# EAGLE design breakout (EAGLE 6.6.0)
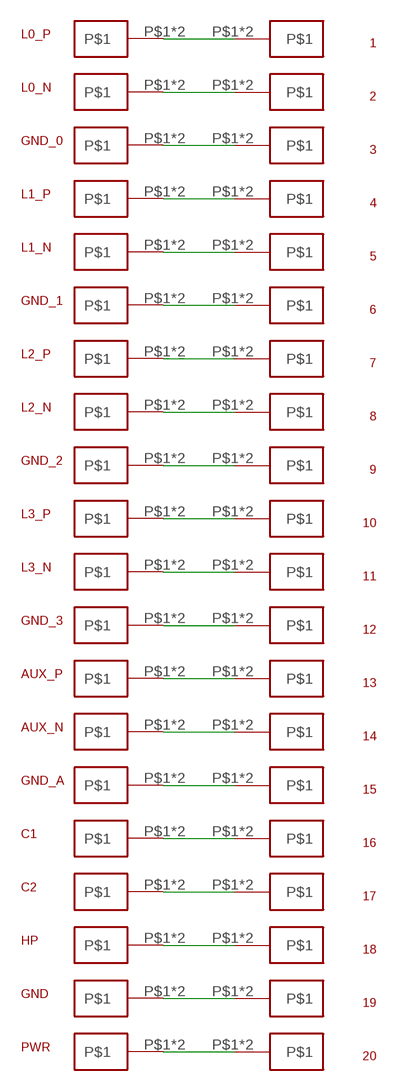
[diagram p0: schematic, sheet 1]

## Parts
1  30_AWG_PAD  [30_AWG_PAD]
2  30_AWG_PAD  [30_AWG_PAD]
3  30_AWG_PAD  [30_AWG_PAD]
4  30_AWG_PAD  [30_AWG_PAD]
5  30_AWG_PAD  [30_AWG_PAD]
6  30_AWG_PAD  [30_AWG_PAD]
7  30_AWG_PAD  [30_AWG_PAD]
8  30_AWG_PAD  [30_AWG_PAD]
9  30_AWG_PAD  [30_AWG_PAD]
10  30_AWG_PAD  [30_AWG_PAD]
11  30_AWG_PAD  [30_AWG_PAD]
12  30_AWG_PAD  [30_AWG_PAD]
13  30_AWG_PAD  [30_AWG_PAD]
14  30_AWG_PAD  [30_AWG_PAD]
15  30_AWG_PAD  [30_AWG_PAD]
16  30_AWG_PAD  [30_AWG_PAD]
17  30_AWG_PAD  [30_AWG_PAD]
18  30_AWG_PAD  [30_AWG_PAD]
19  30_AWG_PAD  [30_AWG_PAD]
20  30_AWG_PAD  [30_AWG_PAD]
AUX_N  30_AWG_PAD  [30_AWG_PAD]
AUX_P  30_AWG_PAD  [30_AWG_PAD]
C1  30_AWG_PAD  [30_AWG_PAD]
C2  30_AWG_PAD  [30_AWG_PAD]
GND  30_AWG_PAD  [30_AWG_PAD]
GND_0  30_AWG_PAD  [30_AWG_PAD]
GND_1  30_AWG_PAD  [30_AWG_PAD]
GND_2  30_AWG_PAD  [30_AWG_PAD]
GND_3  30_AWG_PAD  [30_AWG_PAD]
GND_A  30_AWG_PAD  [30_AWG_PAD]
HP  30_AWG_PAD  [30_AWG_PAD]
L0_N  30_AWG_PAD  [30_AWG_PAD]
L0_P  30_AWG_PAD  [30_AWG_PAD]
L1_N  30_AWG_PAD  [30_AWG_PAD]
L1_P  30_AWG_PAD  [30_AWG_PAD]
L2_N  30_AWG_PAD  [30_AWG_PAD]
L2_P  30_AWG_PAD  [30_AWG_PAD]
L3_N  30_AWG_PAD  [30_AWG_PAD]
L3_P  30_AWG_PAD  [30_AWG_PAD]
PWR  30_AWG_PAD  [30_AWG_PAD]

## Nets
N$1: 1.P$1 1.P$2 L0_P.P$1 L0_P.P$2
N$2: 2.P$1 2.P$2 L0_N.P$1 L0_N.P$2
N$3: 3.P$1 3.P$2 GND_0.P$1 GND_0.P$2
N$4: 4.P$1 4.P$2 L1_P.P$1 L1_P.P$2
N$5: 5.P$1 5.P$2 L1_N.P$1 L1_N.P$2
N$6: 6.P$1 6.P$2 GND_1.P$1 GND_1.P$2
N$7: 7.P$1 7.P$2 L2_P.P$1 L2_P.P$2
N$8: 8.P$1 8.P$2 L2_N.P$1 L2_N.P$2
N$9: 9.P$1 9.P$2 GND_2.P$1 GND_2.P$2
N$10: 10.P$1 10.P$2 L3_P.P$1 L3_P.P$2
N$11: 11.P$1 11.P$2 L3_N.P$1 L3_N.P$2
N$12: 12.P$1 12.P$2 GND_3.P$1 GND_3.P$2
N$13: 13.P$1 13.P$2 AUX_P.P$1 AUX_P.P$2
N$14: 14.P$1 14.P$2 AUX_N.P$1 AUX_N.P$2
N$15: 15.P$1 15.P$2 GND_A.P$1 GND_A.P$2
N$16: 16.P$1 16.P$2 C1.P$1 C1.P$2
N$17: 17.P$1 17.P$2 C2.P$1 C2.P$2
N$18: 18.P$1 18.P$2 HP.P$1 HP.P$2
N$19: 19.P$1 19.P$2 GND.P$1 GND.P$2
N$20: 20.P$1 20.P$2 PWR.P$1 PWR.P$2

## Library data of the parts
1-20 AUX_N AUX_P C1 C2 GND GND_0 GND_1-GND_3 GND_A HP L0_N L0_P L1_N L1_P L2_N L2_P L3_N L3_P PWR = custom:30_AWG_PAD

## Board
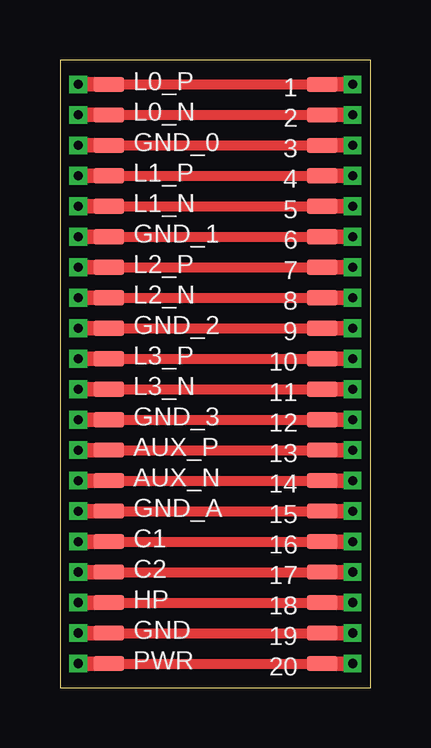
[diagram p1: board, top side]
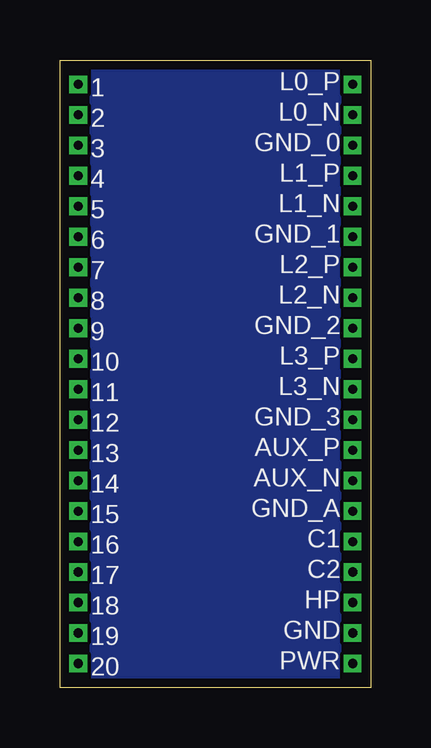
[diagram p2: board, bottom side, seen from below]

Size 12.95 x 26.16 mm. Coordinates in mm from the lower left corner, seen from the top.
Outline: 0,0 12.95,0 12.95,26.16 0,26.16 0,0
Copper layers (1*16): Top 0.0356mm / dielectric 1.5011mm / Bottom 0.0356mm
Design rules "LaenPCBOrder": minimum track width 6mil, minimum drill 13mil, track to track 6mil, track to pad 6mil, pad to pad 6mil, via to via 6mil, smd to smd 6mil, copper to edge 15mil, drill to drill 6mil, minimum pad ring 7mil, minimum via ring 7mil, stop-mask expansion 3mil, vias tented up to drill 0mil, thermal gap 10mil

### Footprints (pad centres in the part's own frame; a part is rotated, then mirrored left to right if it is on the bottom)
30_AWG_PAD = smd 1.27 x 0.635: P$1 0,0 | drill 0.381 pad 0.61 square: P$2 -1.27,0

### Placement (x,y rotation side)
1  10.92,25.15 180 top
2  10.92,23.88 180 top
3  10.92,22.61 180 top
4  10.92,21.34 180 top
5  10.92,20.07 180 top
6  10.92,18.8 180 top
7  10.92,17.53 180 top
8  10.92,16.26 180 top
9  10.92,14.99 180 top
10  10.92,13.72 180 top
11  10.92,12.45 180 top
12  10.92,11.18 180 top
13  10.92,9.91 180 top
14  10.92,8.64 180 top
15  10.92,7.37 180 top
16  10.92,6.1 180 top
17  10.92,4.83 180 top
18  10.92,3.56 180 top
19  10.92,2.29 180 top
20  10.92,1.02 180 top
AUX_N  2.03,8.64 0 top
AUX_P  2.03,9.91 0 top
C1  2.03,6.1 0 top
C2  2.03,4.83 0 top
GND  2.03,2.29 0 top
GND_0  2.03,22.61 0 top
GND_1  2.03,18.8 0 top
GND_2  2.03,14.99 0 top
GND_3  2.03,11.18 0 top
GND_A  2.03,7.37 0 top
HP  2.03,3.56 0 top
L0_N  2.03,23.88 0 top
L0_P  2.03,25.15 0 top
L1_N  2.03,20.07 0 top
L1_P  2.03,21.34 0 top
L2_N  2.03,16.26 0 top
L2_P  2.03,17.53 0 top
L3_N  2.03,12.45 0 top
L3_P  2.03,13.72 0 top
PWR  2.03,1.02 0 top

### Tracks (layer width: path | path; a pad name or v marks a point on that pad's centre or on a via)
N$1
  Top 0.406: L0_P.P$1 1.P$1
  Top 0.61: L0_P.P$2 L0_P.P$1 | 1.P$2 1.P$1
N$2
  Top 0.406: L0_N.P$1 2.P$1
  Top 0.61: L0_N.P$2 L0_N.P$1 | 2.P$2 2.P$1
N$3
  Top 0.406: GND_0.P$1 3.P$1
  Top 0.61: GND_0.P$2 GND_0.P$1 | 3.P$2 3.P$1
N$4
  Top 0.406: L1_P.P$1 4.P$1
  Top 0.61: L1_P.P$2 L1_P.P$1 | 4.P$2 4.P$1
N$5
  Top 0.406: L1_N.P$1 5.P$1
  Top 0.61: L1_N.P$2 L1_N.P$1 | 5.P$2 5.P$1
N$6
  Top 0.406: GND_1.P$1 6.P$1
  Top 0.61: GND_1.P$2 GND_1.P$1 | 6.P$2 6.P$1
N$7
  Top 0.406: L2_P.P$1 7.P$1
  Top 0.61: L2_P.P$2 L2_P.P$1 | 7.P$2 7.P$1
N$8
  Top 0.406: L2_N.P$1 8.P$1
  Top 0.61: L2_N.P$2 L2_N.P$1 | 8.P$2 8.P$1
N$9
  Top 0.406: GND_2.P$1 9.P$1
  Top 0.61: GND_2.P$2 GND_2.P$1 | 9.P$2 9.P$1
N$10
  Top 0.406: L3_P.P$1 10.P$1
  Top 0.61: L3_P.P$2 L3_P.P$1 | 10.P$2 10.P$1
N$11
  Top 0.406: L3_N.P$1 11.P$1
  Top 0.61: L3_N.P$2 L3_N.P$1 | 11.P$2 11.P$1
N$12
  Top 0.406: GND_3.P$1 12.P$1
  Top 0.61: GND_3.P$2 GND_3.P$1 | 12.P$2 12.P$1
N$13
  Top 0.406: AUX_P.P$1 13.P$1
  Top 0.61: AUX_P.P$2 AUX_P.P$1 | 13.P$2 13.P$1
N$14
  Top 0.406: AUX_N.P$1 14.P$1
  Top 0.61: AUX_N.P$2 AUX_N.P$1 | 14.P$2 14.P$1
N$15
  Top 0.406: GND_A.P$1 15.P$1
  Top 0.61: GND_A.P$2 GND_A.P$1 | 15.P$2 15.P$1
N$16
  Top 0.406: C1.P$1 16.P$1
  Top 0.61: C1.P$2 C1.P$1 | 16.P$2 16.P$1
N$17
  Top 0.406: C2.P$1 17.P$1
  Top 0.61: C2.P$2 C2.P$1 | 17.P$2 17.P$1
N$18
  Top 0.406: HP.P$1 18.P$1
  Top 0.61: HP.P$2 HP.P$1 | 18.P$2 18.P$1
N$19
  Top 0.406: GND.P$1 19.P$1
  Top 0.61: GND.P$2 GND.P$1 | 19.P$2 19.P$1
N$20
  Top 0.406: PWR.P$1 20.P$1
  Top 0.61: PWR.P$2 PWR.P$1 | 20.P$2 20.P$1
N$21
  pour Bottom: 0,0 12.95,0 12.95,26.16 0,26.16